# EAGLE design 607_motor (EAGLE 9.6.2)
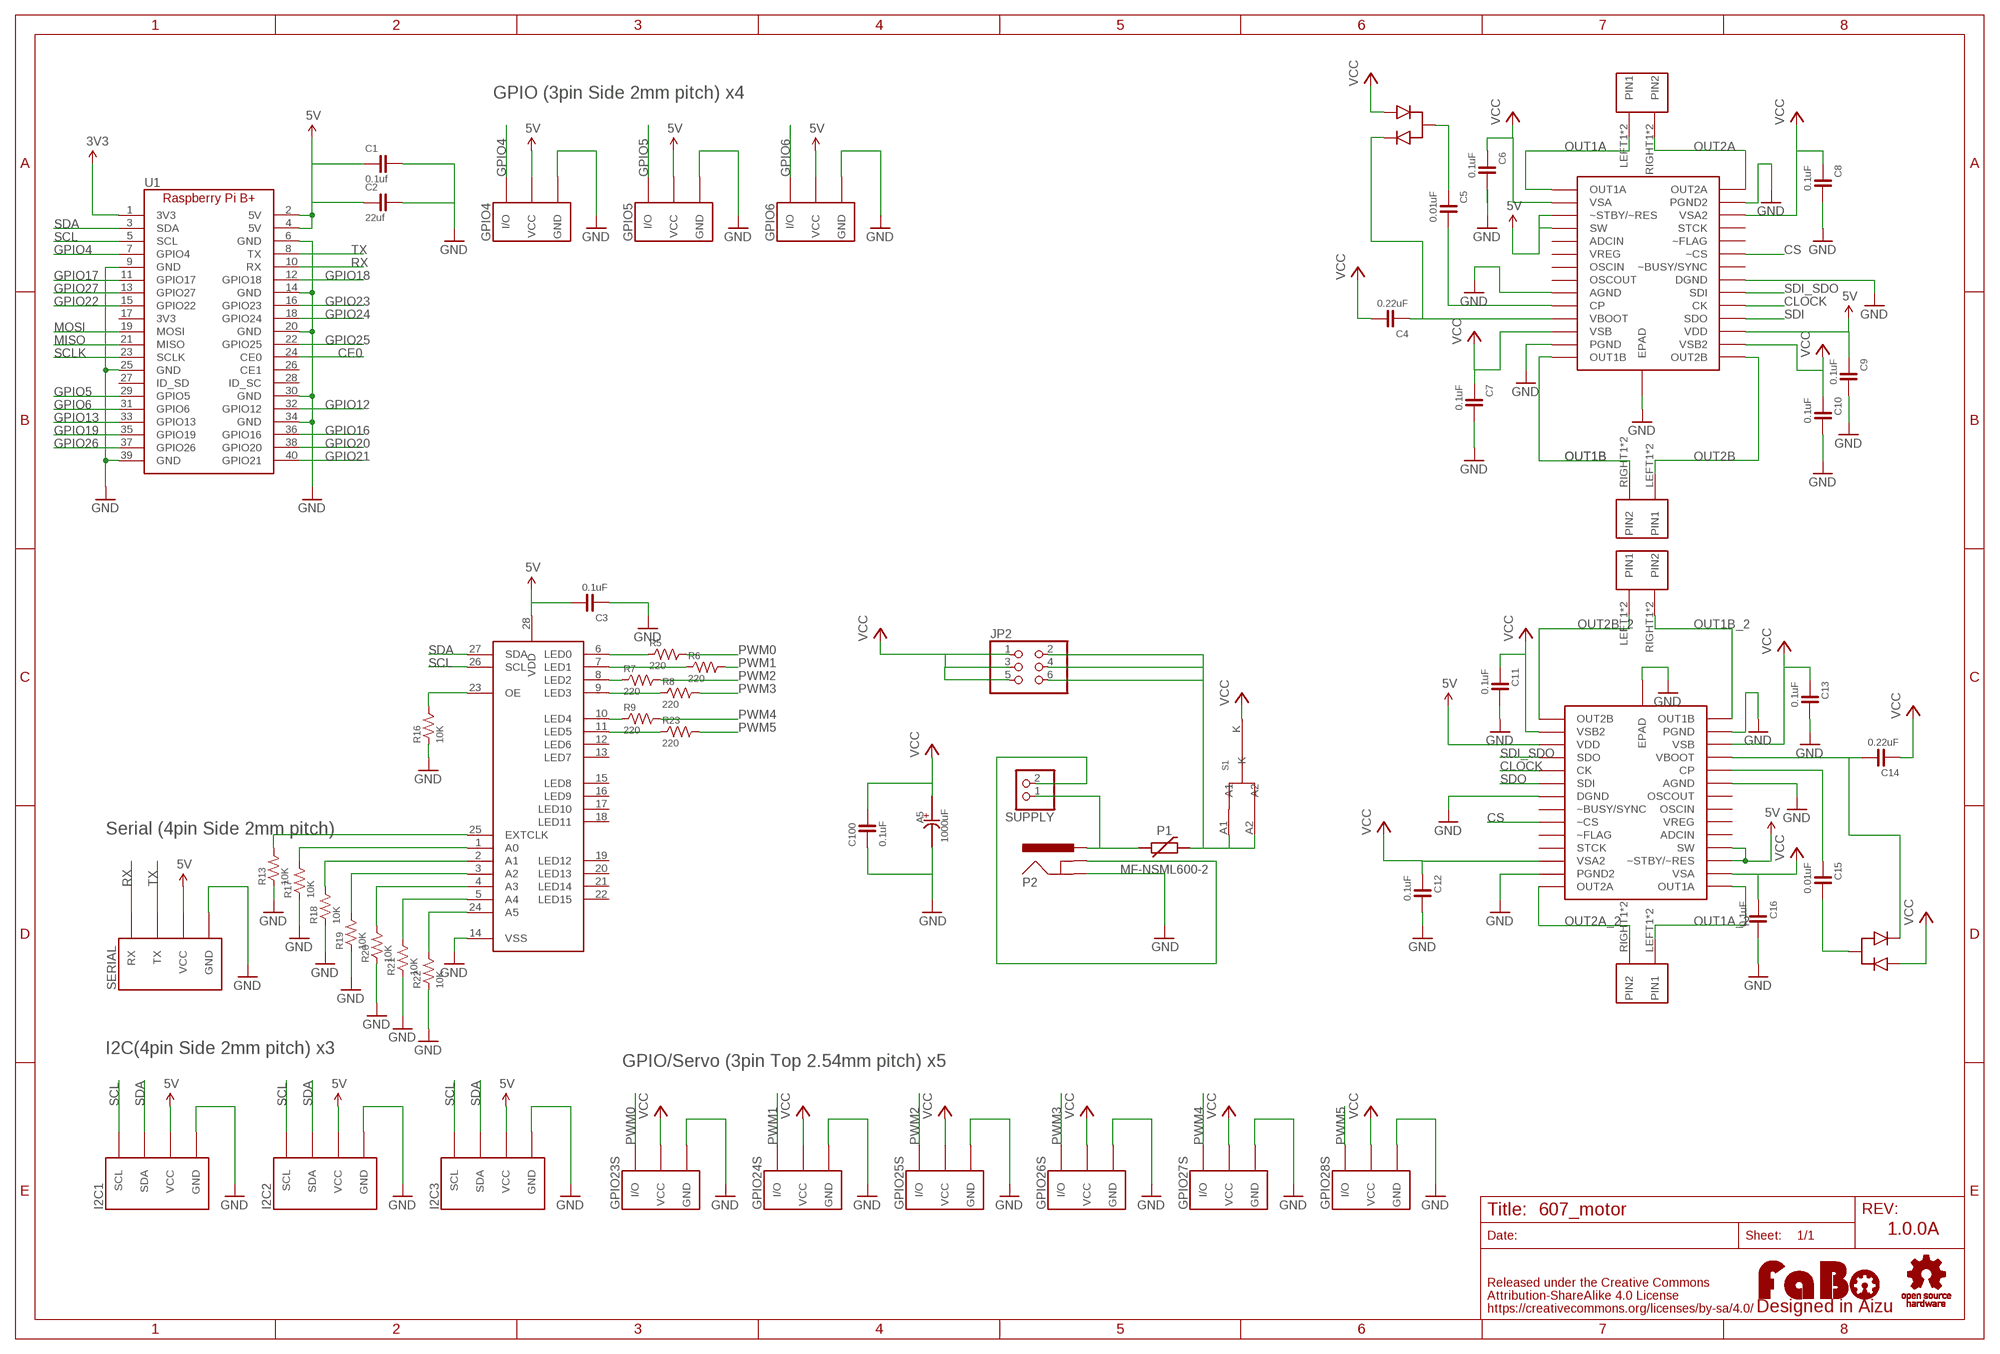
[diagram p0: schematic, sheet 1]

## Parts
A5  1000uF  CAPACITOR-ALUMIN_D12_5  [D12.5]
C1  0.1uf  CAPACITOR-0603  [0603]
C2  22uf  CAPACITOR-0603  [0603]
C3  0.1uF  CAPACITOR-0603  [0603]
C4  0.22uF  CAPACITOR-0603  [0603]
C5  0.01uF  CAPACITOR-0603  [0603]
C6  0.1uF  CAPACITOR-0603  [0603]
C7  0.1uF  CAPACITOR-0603  [0603]
C8  0.1uF  CAPACITOR-0603  [0603]
C9  0.1uF  CAPACITOR-0603  [0603]
C10  0.1uF  CAPACITOR-0603  [0603]
C11  0.1uF  CAPACITOR-0603  [0603]
C12  0.1uF  CAPACITOR-0603  [0603]
C13  0.1uF  CAPACITOR-0603  [0603]
C14  0.22uF  CAPACITOR-0603  [0603]
C15  0.01uF  CAPACITOR-0603  [0603]
C16  0.1uF  CAPACITOR-0603  [0603]
C100  0.1uF  CAPACITOR-0603  [0603]
GPIO4  FABO_BRICK_3PIN-S03B-PASK-2  [FABO_BRICK_3PIN_S03B-PASK-2]
GPIO5  FABO_BRICK_3PIN-S03B-PASK-2  [FABO_BRICK_3PIN_S03B-PASK-2]
GPIO6  FABO_BRICK_3PIN-S03B-PASK-2  [FABO_BRICK_3PIN_S03B-PASK-2]
GPIO23S  FABO_BRICK_3PIN-HEADER  [FABO_BRICK_3PIN_HEADER]
GPIO24S  FABO_BRICK_3PIN-HEADER  [FABO_BRICK_3PIN_HEADER]
GPIO25S  FABO_BRICK_3PIN-HEADER  [FABO_BRICK_3PIN_HEADER]
GPIO26S  FABO_BRICK_3PIN-HEADER  [FABO_BRICK_3PIN_HEADER]
GPIO27S  FABO_BRICK_3PIN-HEADER  [FABO_BRICK_3PIN_HEADER]
GPIO28S  FABO_BRICK_3PIN-HEADER  [FABO_BRICK_3PIN_HEADER]
I2C1  FABO_BRICK_I2C-S04B-PASK-2  [FABO_BRICK_I2C_S04B-PASK-2]
I2C2  FABO_BRICK_I2C-S04B-PASK-2  [FABO_BRICK_I2C_S04B-PASK-2]
I2C3  FABO_BRICK_I2C-S04B-PASK-2  [FABO_BRICK_I2C_S04B-PASK-2]
JP2  PINHD-2X3  [2X03]
LOGO1  LOGO_FABO-M  [LOGO_FABO_M]
P1  MF-NSML600-2  POLYSWITCH1206  [1206]
P2  DC-JACKM04339A0  [M04339A0]
R5  220  RESISTOR-0603  [0603]
R6  220  RESISTOR-0603  [0603]
R7  220  RESISTOR-0603  [0603]
R8  220  RESISTOR-0603  [0603]
R9  220  RESISTOR-0603  [0603]
R13  10K  RESISTOR-0402  [0402]
R16  10K  RESISTOR-0603  [0603]
R17  10K  RESISTOR-0603  [0603]
R18  10K  RESISTOR-0603  [0603]
R19  10K  RESISTOR-0603  [0603]
R20  10K  RESISTOR-0603  [0603]
R21  10K  RESISTOR-0603  [0603]
R22  10K  RESISTOR-0402  [0402]
R23  220  RESISTOR-0603  [0603]
S1  STPS15L30C  [STPS15L30C]
SERIAL  FABO_BRICK_SERIAL-S04B-PASK-2  [FABO_BRICK_SERIAL_S04B-PASK-2]
SUPPLY  PINHD-1X2  [1X02]
U1  RASPBERRY_PI_B+  [RASPBERRY_PI_B+]
U$4  LOGO_OSHW-M_BOTTOM  [LOGO_OSHW_M_BOTTOM]
U$8  L6470L6470  [L6470]
U$9  PCA9685  [PCA9685]
U$10  BAV99  [BAV99]
U$11  L6470L6470  [L6470]
U$12  BAV99  [BAV99]
U$13  ML-1400-S1  [ML-1400-S1]
U$15  ML-1400-S1  [ML-1400-S1]
U$16  ML-1400-S1  [ML-1400-S1]
U$17  ML-1400-S1  [ML-1400-S1]

## Nets
3V3: U1.1(3V3)
5V: C1.1 C2.1 C3.2 C9.1 GPIO4.VCC GPIO5.VCC GPIO6.VCC I2C1.VCC I2C2.VCC I2C3.VCC SERIAL.VCC U1.2(5V) U1.4(5V) U$8.VDD U$8.~STBY/~RES U$9.28(VDD) U$11.SW U$11.VDD U$11.~STBY/~RES
CE0: U1.24(CE0)
CLOCK: U$8.CK U$11.CK
CS: U$8.~CS U$11.~CS
GND: A5.- C1.2 C2.2 C3.1 C6.2 C7.2 C8.2 C9.2 C10.2 C11.2 C12.2 C13.2 C16.2 C100.1 GPIO4.GND GPIO5.GND GPIO6.GND GPIO23S.GND GPIO24S.GND GPIO25S.GND GPIO26S.GND GPIO27S.GND GPIO28S.GND I2C1.GND I2C2.GND I2C3.GND P2.GND R13.P$1 R16.1 R17.1 R18.1 R19.1 R20.1 R21.1 R22.P$1 SERIAL.GND U1.6(GND) U1.9(GND) U1.14(GND) U1.20(GND) U1.25(GND) U1.30(GND) U1.34(GND) U1.39(GND) U$8.AGND U$8.DGND U$8.EPAD U$8.PGND U$8.PGND2 U$9.14(VSS) U$11.AGND U$11.DGND U$11.EPAD U$11.PGND U$11.PGND2
GPIO4: GPIO4.I/O U1.7(GPIO4)
GPIO5: GPIO5.I/O U1.29(GPIO5)
GPIO6: GPIO6.I/O U1.31(GPIO6)
GPIO12: U1.32(GPIO12)
GPIO13: U1.33(GPIO13)
GPIO16: U1.36(GPIO16)
GPIO17: U1.11(GPIO17)
GPIO18: U1.12(GPIO18)
GPIO19: U1.35(GPIO19)
GPIO20: U1.38(GPIO20)
GPIO21: U1.40(GPIO21)
GPIO22: U1.15(GPIO22)
GPIO23: U1.16(GPIO23)
GPIO24: U1.18(GPIO24)
GPIO25: U1.22(GPIO25)
GPIO26: U1.37(GPIO26)
GPIO27: U1.13(GPIO27)
LED0: R5.1 U$9.6(LED0)
LED1: R6.1 U$9.7(LED1)
LED2: R7.1 U$9.8(LED2)
LED3: R8.1 U$9.9(LED3)
LED4: R9.1 U$9.10(LED4)
LED5: R23.1 U$9.11(LED5)
MISO: U1.21(MISO)
MOSI: U1.19(MOSI)
N$3: C14.2 U$11.VBOOT U$12.CASORD
N$5: P1.P$1 P2.VCC(PWR) SUPPLY.1
N$7: R16.2 U$9.23(OE)
N$8: R13.P$2 U$9.25(EXTCLK)
N$9: R17.2 U$9.1(A0)
N$10: R18.2 U$9.2(A1)
N$11: R19.2 U$9.3(A2)
N$12: R20.2 U$9.4(A3)
N$13: R21.2 U$9.5(A4)
N$14: R22.P$2 U$9.24(A5)
N$15: JP2.2 JP2.4 JP2.6 P1.P$2 S1.A1 S1.A2
N$16: C4.1 U$8.VBOOT U$10.CASORD
N$17: P2.GNDBREAK SUPPLY.2
N$18: C5.1 U$10.A/C
N$25: C15.2 U$12.A/C
N$26: C15.1 U$11.CP
N$27: C5.2 U$8.CP
N$28: U$8.SW
OUT1A: U$8.OUT1A U$15.LEFT1(PIN1) U$15.LEFT2(PIN1)
OUT1A_2: U$11.OUT1A U$17.LEFT1(PIN1) U$17.LEFT2(PIN1)
OUT1B: U$8.OUT1B U$13.RIGHT1(PIN2) U$13.RIGHT2(PIN2)
OUT1B_2: U$11.OUT1B U$16.RIGHT1(PIN2) U$16.RIGHT2(PIN2)
OUT2A: U$8.OUT2A U$15.RIGHT1(PIN2) U$15.RIGHT2(PIN2)
OUT2A_2: U$11.OUT2A U$17.RIGHT1(PIN2) U$17.RIGHT2(PIN2)
OUT2B: U$8.OUT2B U$13.LEFT1(PIN1) U$13.LEFT2(PIN1)
OUT2B_2: U$11.OUT2B U$16.LEFT1(PIN1) U$16.LEFT2(PIN1)
PWM0: GPIO23S.I/O R5.2
PWM1: GPIO24S.I/O R6.2
PWM2: GPIO25S.I/O R7.2
PWM3: GPIO26S.I/O R8.2
PWM4: GPIO27S.I/O R9.2
PWM5: GPIO28S.I/O R23.2
RX: SERIAL.RX U1.10(RX)
SCL: I2C1.SCL I2C2.SCL I2C3.SCL U1.5(SCL) U$9.26(SCL)
SCLK: U1.23(SCLK)
SDA: I2C1.SDA I2C2.SDA I2C3.SDA U1.3(SDA) U$9.27(SDA)
SDI: U$8.SDO
SDI_SDO: U$8.SDI U$11.SDO
SDO: U$11.SDI
TX: SERIAL.TX U1.8(TX)
VCC: A5.+ C4.2 C6.1 C7.1 C8.1 C10.1 C11.1 C12.1 C13.1 C14.1 C16.1 C100.2 GPIO23S.VCC GPIO24S.VCC GPIO25S.VCC GPIO26S.VCC GPIO27S.VCC GPIO28S.VCC JP2.1 JP2.3 JP2.5 S1.K U$8.VSA U$8.VSA2 U$8.VSB U$8.VSB2 U$10.ANORD U$11.VSA U$11.VSA2 U$11.VSB U$11.VSB2 U$12.ANORD
Unconnected: U1.17(3V3) U1.26(CE1) U1.27(ID_SD) U1.28(ID_SC) U$8.ADCIN U$8.OSCIN U$8.OSCOUT U$8.STCK U$8.VREG U$8.~BUSY/RST(~BUSY/SYNC) U$8.~FLAG U$9.12(LED6) U$9.13(LED7) U$9.15(LED8) U$9.16(LED9) U$9.17(LED10) U$9.18(LED11) U$9.19(LED12) U$9.20(LED13) U$9.21(LED14) U$9.22(LED15) U$11.ADCIN U$11.OSCIN U$11.OSCOUT U$11.STCK U$11.VREG U$11.~BUSY/RST(~BUSY/SYNC) U$11.~FLAG

## Notes on the sheet
- GPIO (3pin Side 2mm pitch) x4
- Serial (4pin Side 2mm pitch)
- I2C(4pin Side 2mm pitch) x3
- GPIO/Servo (3pin Top 2.54mm pitch) x5
- 1.0.0A

## Library data of the parts
A5 = FaBo-Capacitor:CAPACITOR-ALUMIN
C1-C16 C100 = FaBo-Capacitor:CAPACITOR: CAPACITOR
GPIO4-GPIO6 GPIO23S GPIO24S GPIO25S GPIO26S GPIO27S GPIO28S = FaBo-Template:FABO_BRICK_3PIN: FaBo Brick 3pin
I2C1-I2C3 = FaBo-Template:FABO_BRICK_I2C: FaBo Brick I2C
JP2 = pinhead:PINHD-2X3: PIN HEADER
LOGO1 = component:LOGO_FABO
P1 = FaBo-Supply:POLYSWITCH
P2 = FaBo-Supply:DC-JACK
R5-R9 R13 R16-R23 = FaBo-Resistors:RESISTOR: RESISTOR
S1 = FaBo-Supply:STPS15L30C
SERIAL = FaBo-Template:FABO_BRICK_SERIAL: FaBo Brick Serial
SUPPLY = pinhead:PINHD-1X2: PIN HEADER
U1 = FaBo-Boards:RASPBERRY_PI_B+
U$4 = component:LOGO_OSHW
U$8 U$11 = Myparts:L6470
U$9 = FaBo-Motor:PCA9685
U$10 U$12 = Myparts:BAV99
U$13 U$15-U$17 = FaBo-Terminal:ML-1400-S1

## Board
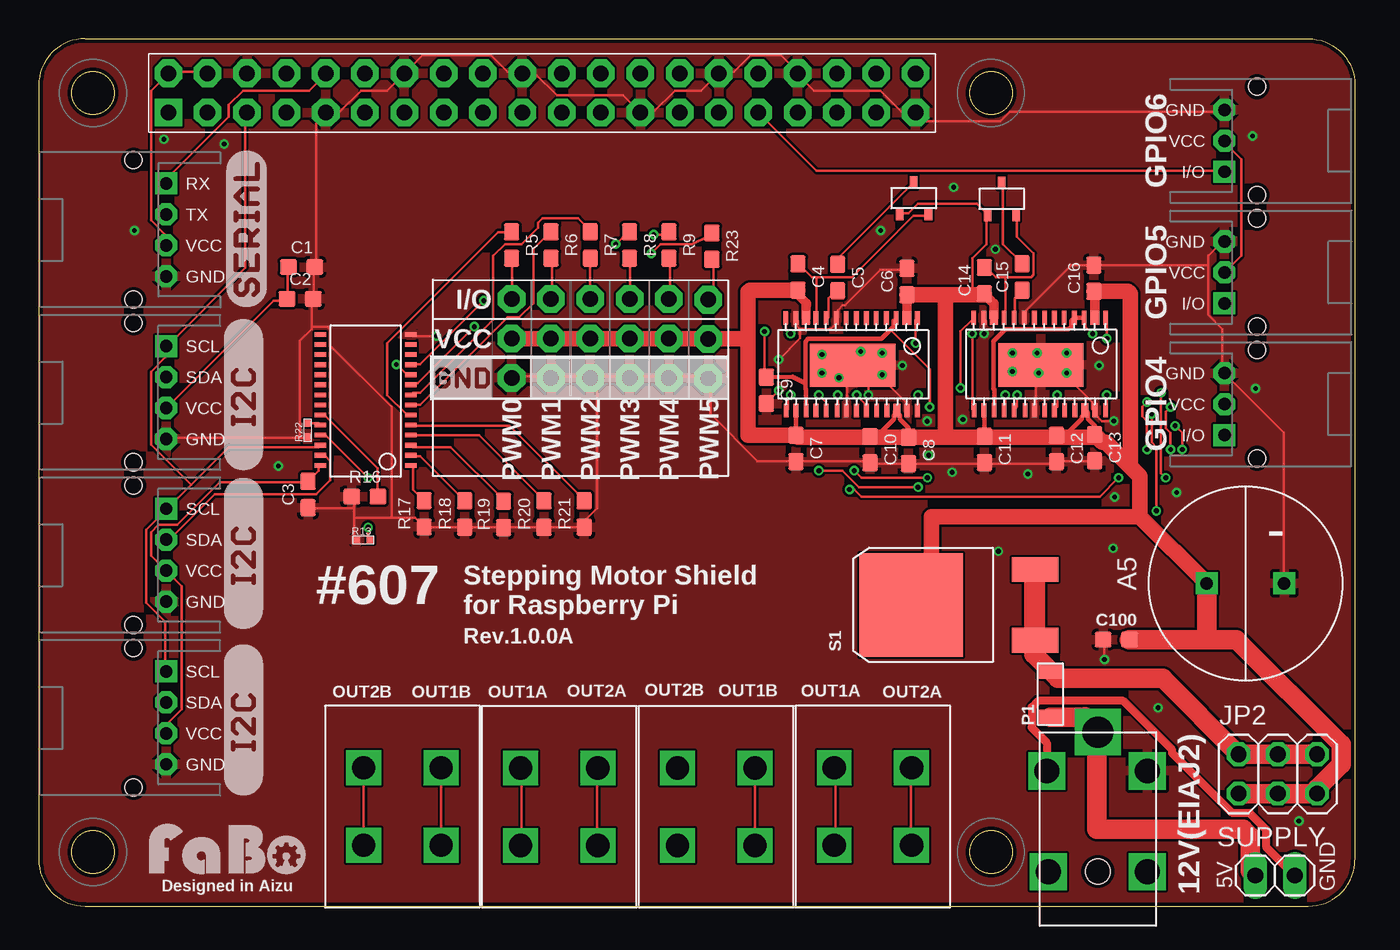
[diagram p1: board, top side]
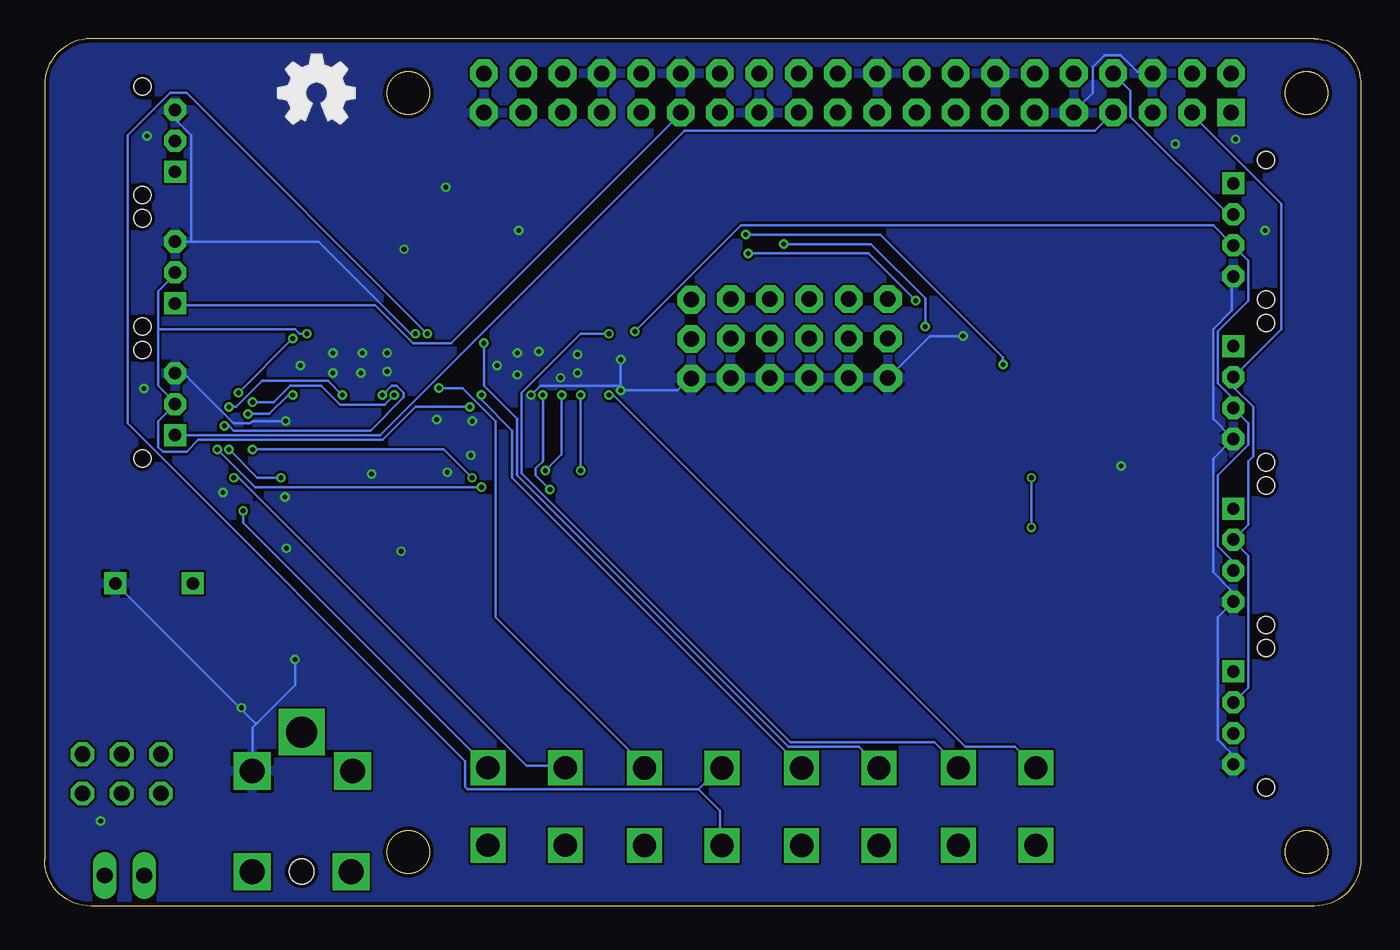
[diagram p2: board, bottom side, seen from below]

Size 85 x 56 mm. Coordinates in mm from the lower left corner, seen from the top.
Copper layers (1*16): Top 0.035mm / dielectric 1.6mm / Bottom 0.035mm
Design rules "PCBway": minimum track width 6mil, minimum drill 12mil, track to track 6mil, track to pad 6mil, pad to pad 6mil, via to via 6mil, smd to smd 6mil, copper to edge 10mil, drill to drill 10mil, minimum pad ring 10mil, minimum via ring 6mil, stop-mask expansion 2mil, vias tented up to drill 100mil, thermal gap 8mil

### Footprints (pad centres in the part's own frame; a part is rotated, then mirrored left to right if it is on the bottom)
D12.5 = drill 0.8 pad 1.422 square: + -2.472,0.254; - 2.528,0.254
0603 = smd 1.1 x 1: 1 -0.85,0; 2 0.85,0
FABO_BRICK_3PIN_S03B-PASK-2 = drill 0.8 pad 1.422 octagon: GND -2,0; VCC 0,0 | drill 0.8 pad 1.422 square: I/O 2,0 | hole 1.1: 3.5,2.1; -3.5,2.1
FABO_BRICK_3PIN_HEADER = drill 1 pad 1.778 octagon: GND -2.54,0; I/O 2.54,0; VCC 0,0
FABO_BRICK_I2C_S04B-PASK-2 = drill 0.8 pad 1.422 octagon: GND -3,0; SDA 1,0; VCC -1,0 | drill 0.8 pad 1.422 square: SCL 3,0 | hole 1.1: 4.5,2.1; -4.5,2.1
2X03 = drill 1.016 octagon: 1 -2.54,-1.27; 2 -2.54,1.27; 3 0,-1.27; 4 0,1.27; 5 2.54,-1.27; 6 2.54,1.27
1206 = smd 1 x 1.6: P$1 -1.5,0; P$2 1.5,0
M04339A0 = drill 1.6 square: GND -3.2,-6.5; GNDBREAK 3.3,-6.5; ND1 -3.2,0; ND2 3.2,0 | drill 2 square: VCC 0,-9 | hole 1.6: 0,0
0402 = smd 0.5 x 0.5: P$1 -0.46,0; P$2 0.46,0
STPS15L30C = smd 1.6 x 3: A1 -2.286,-6.13; A2 2.286,-6.13 | smd 6.7 x 6.7: K 0,1.87
FABO_BRICK_SERIAL_S04B-PASK-2 = drill 0.8 pad 1.422 octagon: GND -3,0; TX 1,0; VCC -1,0 | drill 0.8 pad 1.422 square: RX 3,0 | hole 1.1: 4.5,2.1; -4.5,2.1
1X02 = drill 1.016 long: 1 -1.27,0; 2 1.27,0
RASPBERRY_PI_B+ = drill 1 pad 1.778 square: 1 0,-2.54 | drill 1 pad 1.778 octagon: 2 0,0; 3 2.54,-2.54; 4 2.54,0; 5 5.08,-2.54; 6 5.08,0; 7 7.62,-2.54; 8 7.62,0; 9 10.16,-2.54; 10 10.16,0; 11 12.7,-2.54; 12 12.7,0; 13 15.24,-2.54; 14 15.24,0; 15 17.78,-2.54; 16 17.78,0; 17 20.32,-2.54; 18 20.32,0; 19 22.86,-2.54; 20 22.86,0; 21 25.4,-2.54; 22 25.4,0; 23 27.94,-2.54; 24 27.94,0; 25 30.48,-2.54; 26 30.48,0; 27 33.02,-2.54; 28 33.02,0; 29 35.56,-2.54; 30 35.56,0; 31 38.1,-2.54; 32 38.1,0; 33 40.64,-2.54; 34 40.64,0; 35 43.18,-2.54; 36 43.18,0; 37 45.72,-2.54; 38 45.72,0; 39 48.26,-2.54; 40 48.26,0
L6470 = smd 0.889 x 0.305: ADCIN -0.802,-3.335; AGND -0.802,-5.926; CK 5.167,-6.561; CP -0.802,-6.561; DGND 5.167,-5.265; OSCIN -0.802,-4.605; OSCOUT -0.802,-5.265; OUT1A -0.802,-0.668; OUT1B -0.802,-9.177; OUT2A 5.167,-0.668; OUT2B 5.167,-9.152; PGND -0.802,-8.517; PGND2 5.167,-1.354; SDI 5.167,-5.85; SDO 5.167,-7.221; STCK 5.167,-2.649; SW -0.802,-2.675; VBOOT -0.802,-7.221; VDD 5.167,-7.856; VREG -0.802,-3.97; VSB2 5.167,-8.517; ~BUSY/RST 5.167,-4.605; ~CS 5.167,-3.97; ~FLAG 5.167,-3.31; ~STBY/~RES -0.802,-2.04 | smd 2.8 x 5.5: EPAD 2.25,-4.85 | smd 0.889 x 0.559: VSA -0.802,-1.354 | smd 0.889 x 0.457: VSA2 5.167,-1.989 | smd 0.889 x 0.508: VSB -0.802,-7.882
PCA9685 = smd 0.3 x 0.75: 1 -4.15,-2.93; 2 -3.5,-2.93; 3 -2.85,-2.93; 4 -2.2,-2.93; 5 -1.55,-2.93; 6 -0.9,-2.93; 7 -0.25,-2.93; 8 0.4,-2.93; 9 1.05,-2.93; 10 1.7,-2.93; 11 2.35,-2.93; 12 3,-2.93; 13 3.65,-2.93; 14 4.3,-2.93; 15 4.3,2.92; 16 3.65,2.92; 17 3,2.92; 18 2.35,2.92; 19 1.7,2.92; 20 1.05,2.92; 21 0.4,2.92; 22 -0.25,2.92; 23 -0.9,2.92; 24 -1.55,2.92; 25 -2.2,2.92; 26 -2.85,2.92; 27 -3.5,2.92; 28 -4.15,2.92
BAV99 = smd 0.5 x 0.8: A/C 0,1.68; ANORD -0.91,-0.37; CASORD 0.94,-0.37
ML-1400-S1 = drill 1.5 square: LEFT1 -2.5,2.5; LEFT2 -2.5,-2.5; RIGHT1 2.5,2.5; RIGHT2 2.5,-2.5

### Placement (x,y rotation side)
A5  77.9,20.58 0 top
C1  16.98,41.26 0 top
C2  16.88,39.21 0 top
C3  17.39,26.57 90 top
C4  49.03,40.62 270 top
C5  51.6,40.58 270 top
C6  56.07,40.32 90 top
C7  48.9,29.55 270 top
C8  56.17,29.42 270 top
C9  46.99,33.3 270 top
C10  53.69,29.47 270 top
C11  61.08,29.48 270 top
C12  65.73,29.54 270 top
C13  68.19,29.6 270 top
C14  61.07,40.38 90 top
C15  63.51,40.62 90 top
C16  68.14,40.54 90 top
C100  69.59,17.21 0 top
GPIO4  76.58,32.41 270 top
GPIO5  76.58,40.91 270 top
GPIO6  76.58,49.41 270 top
GPIO23S  30.54,36.65 90 top
GPIO24S  33.08,36.65 90 top
GPIO25S  35.62,36.65 90 top
GPIO26S  38.16,36.65 90 top
GPIO27S  40.7,36.65 90 top
GPIO28S  43.25,36.61 90 top
I2C1  8.23,33.16 90 top
I2C2  8.23,22.66 90 top
I2C3  8.23,12.16 90 top
JP2  80.02,8.54 0 top
LOGO1  12.18,1.7 0 top
P1  65.33,13.69 90 top
P2  68.4,2.23 180 top
R5  30.54,42.68 270 top
R6  33.08,42.68 270 top
R7  35.62,42.68 270 top
R8  38.16,42.68 270 top
R9  40.7,42.68 270 top
R13  20.96,23.64 0 top
R16  21.06,26.44 0 top
R17  24.89,25.33 90 top
R18  27.51,25.32 90 top
R19  30.02,25.29 90 top
R20  32.63,25.31 90 top
R21  35.23,25.32 90 top
R22  17.36,30.73 90 top
R23  43.47,42.61 270 top
S1  58.22,19.45 90 top
SERIAL  8.23,43.66 90 top
SUPPLY  79.84,1.98 0 top
U1  8.37,53.77 0 top
U$2  [LOGO_SILK_I2C]  14.48,17.91 90 top
U$3  [LOGO_SILK_SERIAL2]  14.73,38.66 90 top
U$4  67.42,52.5 0 top
U$5  [LOGO_SILK_I2C]  14.48,7.16 90 top
U$6  [LOGO_SILK_I2C]  14.48,28.16 90 top
U$7  [LOGO_SILK_GND]  25.46,32.84 0 top
U$8  57.42,37.17 270 top
U$9  21.11,32.61 90 top
U$10  56.51,45.05 0 top
U$11  69.56,37.19 270 top
U$12  62.19,45 0 top
U$13  23.49,6.43 0 top
U$15  33.61,6.42 0 top
U$16  43.75,6.42 0 top
U$17  53.87,6.43 0 top

### Tracks (layer width: path | path; a pad name or v marks a point on that pad's centre or on a via)
5V  (via drill 0.3)
  Top 0.152: U$8.~STBY/~RES 55.26,37.87 55.2,37.79 | 55.01,37.21 57.54,34.67 v57.54,32.23 | GPIO6.VCC 76.59,49.3 77.66,48.23 77.66,41.98 76.59,40.92 GPIO5.VCC | v68.06,36.96 67.6,37.41 67.6,37.87 U$11.~STBY/~RES | U$9.28 18.07,28.42 18.07,28.12 17.46,27.51 C3.2 17.31,27.35 11.67,27.35 8.93,24.61 7.71,24.61 7.25,24.15 7.25,22.63 8.17,21.72 I2C2.VCC 8.32,21.56 9.23,20.65 9.23,12.72 8.32,11.81 8.32,11.2 I2C3.VCC | C1.1 16.09,41.22 16.09,39.24 C2.1 15.94,39.09 15.18,39.09 8.32,32.23 I2C1.VCC | SERIAL.VCC 8.17,42.75 8.17,43.36 7.25,44.27 7.25,52.65 U1.2 8.47,53.87 10.91,53.87 U1.4 | v46.88,37.11 46.88,34.21 C9.1
  Top 0.305: 55.2,37.79 55.2,37.4 55.01,37.21 54.43,36.63 49.69,36.63 49.51,36.45 49.51,33.77 | 49.51,33.77 49.51,33.39 49.56,33.35 U$8.VDD | U$11.~STBY/~RES U$11.SW 66.68,37.79 66.68,37.42 66.5,37.24 62.43,37.24 61.65,36.47 61.65,34.1 61.65,33.41 61.7,33.37 U$11.VDD | 49.51,33.77 48.67,34.18 C9.1
  Bottom 0.152: v57.54,32.23 61.05,32.23 63.18,30.1 75.07,30.1 75.83,29.34 77.36,29.34 77.66,29.64 77.66,31.32 76.59,32.38 GPIO4.VCC 76.59,32.54 77.66,33.6 77.66,37.26 | 77.66,37.26 77.66,39.7 76.59,40.77 GPIO5.VCC | v68.06,36.96 68.52,36.96 68.82,37.26 77.66,37.26 | I2C2.VCC 8.32,21.72 8.32,22.33 9.23,23.24 9.23,27.81 7.25,29.79 7.25,31.16 8.17,32.08 I2C1.VCC 8.32,32.23 8.32,32.84 9.23,33.76 9.23,37.11 7.25,39.09 7.25,41.68 8.17,42.59 SERIAL.VCC 8.32,42.75 9.54,43.97 40.02,43.97 v46.88,37.11
CLOCK  (via drill 0.3)
  Top 0.152: v50.38,32.99 50.84,32.54 50.84,32.08 U$8.CK | v50.38,28.12 51.91,28.12 52.97,27.05 v56.78,27.05 | v73.85,29.49 73.85,30.55 v73.39,31.01 | v63.18,32.99 63.18,32.23 63.03,32.08 U$11.CK
  Bottom 0.152: v50.38,28.12 v50.38,32.99 | v56.78,27.05 71.41,27.05 v73.85,29.49 | v73.39,31.01 73.09,31.01 72.78,30.71 63.95,30.71 61.81,32.84 61.81,33.15 62.27,33.6 62.57,33.6 v63.18,32.99
CS  (via drill 0.3)
  Top 0.152: v52.82,32.99 53.43,32.38 53.43,32.08 U$8.~CS | v52.36,26.9 52.67,26.9 53.12,26.44 68.52,26.44 v69.74,27.66 | v73.09,29.49 73.09,30.55 72.78,30.86 72.78,31.93 v73.09,32.23 | v65.77,32.99 65.77,32.23 65.62,32.08 U$11.~CS
  Bottom 0.152: v52.82,32.99 52.82,28.73 53.28,28.27 53.28,27.81 v52.36,26.9 | v69.74,27.66 71.26,27.66 v73.09,29.49 | v73.09,32.23 72.63,32.23 70.96,33.91 66.69,33.91 v65.77,32.99
GND  (via drill 0.3)
  Top 0.152: 20.36,25.68 20.36,26.44 R16.1 | 20.36,25.68 20.36,25.07 | 20.36,25.07 20.36,23.7 R13.P$1 | 20.36,25.68 17.46,25.68 C3.1 | 22.8,25.07 24.32,25.07 24.78,24.61 R17.1 24.93,24.46 27.37,24.46 R18.1 27.52,24.46 29.96,24.46 R19.1 30.11,24.46 32.55,24.46 R20.1 32.7,24.46 35.14,24.46 R21.1 35.29,24.61 35.29,24.92 36.06,25.68 36.06,34.21 | 22.8,25.07 20.36,25.07 | C13.2 68.06,28.73 65.77,28.73 C12.2 65.62,28.57 61.2,28.57 C11.2 61.05,28.57 C8.2 56.02,28.57 53.73,28.57 C10.2 53.58,28.73 49.01,28.73 C7.2 48.86,28.73 46.42,28.73 43.37,31.77 43.37,34.06 GPIO28S.GND 43.22,34.21 40.78,34.21 GPIO27S.GND 40.63,34.21 38.19,34.21 GPIO26S.GND 38.04,34.21 36.06,34.21 | 52.21,33.6 52.21,34.52 52.51,34.82 U$8.EPAD | 52.21,33.6 52.21,32.08 U$8.DGND | 52.21,33.6 53.58,33.6 | 53.58,33.6 54.95,33.6 56.02,32.54 56.02,32.08 U$8.PGND2 | 52.21,33.6 U$8.EPAD | v25.69,36.8 24.17,36.8 U$9.14 | GPIO25S.GND 35.6,34.21 33.16,34.21 GPIO24S.GND 33.01,34.21 30.57,34.21 GPIO23S.GND | 36.06,34.21 35.75,34.21 GPIO25S.GND | 49.16,37.26 48.86,37.57 48.86,37.87 U$8.PGND | 49.16,37.26 51.14,37.26 51.45,37.57 51.45,37.87 U$8.AGND 51.6,38.02 51.6,38.48 51.91,38.78 52.06,38.78 54.34,41.07 56.02,41.07 C6.2 | v47.79,33.3 47.03,32.54 C9.2 | 49.16,37.26 49.16,36.65 v47.79,35.28 | v53.58,32.99 53.58,33.6 | 53.58,33.6 U$8.EPAD | 36.06,34.21 GPIO25S.GND | v68.82,15.92 68.82,17.14 C100.1 | 64.4,33.6 64.4,34.52 64.71,34.82 U$11.EPAD 64.4,33.6 | 64.4,33.6 64.4,32.08 U$11.DGND | 64.4,33.6 66.99,33.6 68.06,32.54 68.06,32.08 U$11.PGND2 68.21,31.93 68.21,31.77 68.67,31.32 v69.43,31.32 | U$11.AGND 63.64,38.02 63.64,38.33 66.69,41.38 68.06,41.38 C16.2 68.21,41.38 75.53,41.38
  Top 0.152: v61.05,36.96 61.05,37.87 U$11.PGND | 75.53,41.38 75.53,41.98 76.44,42.9 GPIO5.GND | 75.53,41.38 75.53,38.17 76.44,37.26 76.44,34.52 GPIO4.GND 76.59,34.36 80.4,30.55 80.4,20.95 A5.- | 16.85,30.25 8.32,30.25 I2C1.GND | 16.85,30.25 17.31,30.25 R22.P$1 | 17.62,37.41 17.62,37.26 16.85,36.5 16.85,30.25 | 17.62,37.41 17.62,39.09 C2.2 17.77,39.24 17.77,41.22 C1.2 17.92,41.38 17.92,50.52 18.53,51.13 U1.9 18.53,51.28 19.44,51.28 20.82,52.65 22.49,52.65 U1.14 24.78,54.94 29.2,54.94 30.27,53.87 31.18,53.87 U1.20 31.33,53.72 32.09,53.72 33.46,52.35 37.73,52.35 U1.25 38.95,51.28 39.71,51.28 41.08,52.65 42.76,52.65 43.83,53.72 U1.30 43.98,53.87 44.89,53.87 45.96,54.94 47.94,54.94 49.01,53.87 U1.34 49.01,53.72 50.08,52.65 54.34,52.65 55.72,51.28 56.63,51.28 U1.39 56.63,51.13 57.09,50.67 62.12,50.67 62.73,51.28 76.44,51.28 GPIO6.GND | 22.8,25.07 22.8,32.23 18.84,36.19 18.84,37.26 18.68,37.41 17.62,37.41
  Bottom 0.152: v25.69,36.8 27.83,36.8 30.42,34.21 GPIO23S.GND | GPIO28S.GND 43.37,34.06 44.13,33.3 v47.79,33.3 47.79,33.6 | 47.79,33.6 v47.79,35.28 | v53.58,32.99 52.97,33.6 47.79,33.6 | v68.82,15.92 68.82,14.25 71.26,11.81 | 71.26,11.81 71.56,11.5 71.56,8.76 P2.GND | 71.26,11.81 71.41,11.81 80.4,20.8 A5.- | v61.05,36.96 61.35,36.96 67.3,42.9 75.53,42.9 | 75.53,42.9 76.44,42.9 GPIO5.GND | 75.53,42.9 75.53,49.76 76.44,50.67 76.44,51.28 GPIO6.GND | v69.43,31.32 71.56,31.32 71.72,31.16 72.78,31.16 75.98,34.36 76.44,34.36 GPIO4.GND | I2C3.GND 8.32,9.22 8.32,9.83 9.23,10.74 9.23,18.67 8.32,19.58 I2C2.GND 8.32,19.73 8.32,20.34 9.54,21.56 9.54,28.88 8.32,30.1 I2C1.GND 8.32,30.25 9.54,31.47 9.54,37.26 8.32,38.48 8.32,40.61 SERIAL.GND | U1.6 13.5,53.87 14.41,53.87 15.48,54.94 16.55,54.94 17.31,54.18 17.31,52.5 18.53,51.28 U1.9
  other vias: 61.98,22.91 72.28,12.81 81.38,5.51 15.48,28.41 62.88,35.71 64.48,35.71 66.38,35.71 66.38,34.41 64.58,34.41 62.88,34.51 54.48,35.71 54.48,34.31 50.58,34.41 50.58,35.61 53.08,35.81 51.68,34.11 68.48,34.91 55.78,34.91 58.98,28.01 63.88,27.91 73.48,26.71 69.38,23.11 69.48,26.41 78.58,33.41 54.38,43.61 59.08,46.41 61.78,42.41 57.48,29.11 59.68,31.41 57.38,31.31 6.18,43.61 11.98,49.21 8.08,49.51 78.38,49.71
  pour Bottom: -0.52,-0.84 -0.52,56.66 85.73,56.66 85.73,-0.84
  pour Top: -0.52,-0.84 -0.52,56.66 85.73,56.66 85.73,-0.84
GPIO4
  Bottom 0.152: U1.7 17.16,50.06 43.68,50.06 63.34,30.4 76.44,30.4 GPIO4.I/O
GPIO5
  Bottom 0.152: GPIO5.I/O 76.44,38.78 63.64,38.78 61.2,36.35 58.76,36.35 43.98,51.13 U1.29
GPIO6
  Top 0.152: U1.31 50.23,47.47 76.44,47.47 GPIO6.I/O
LED0
  Top 0.152: U$9.6 24.02,31.77 23.71,31.77 22.49,32.99 22.49,36.35 29.66,43.51 30.42,43.51 R5.1
LED1
  Top 0.152: U$9.7 24.17,32.38 24.63,32.38 30.27,38.02 31.03,38.02 31.94,38.94 31.94,42.44 33.01,43.51 R6.1
LED2
  Top 0.152: U$9.8 24.17,33.15 24.63,33.15 29.35,37.87 29.35,41.98 30.11,42.75 31.18,42.75 32.25,43.81 32.25,44.12 32.55,44.42 34.84,44.42 35.6,43.66 R7.1
LED3  (via drill 0.3)
  Top 0.152: v28.13,37.41 24.47,33.76 24.17,33.76 U$9.9 | v37.27,42.75 38.04,43.51 R8.1
  Bottom 0.152: v28.13,37.41 28.13,39.24 31.64,42.75 v37.27,42.75
LED4  (via drill 0.3)
  Top 0.152: v23.1,34.97 23.71,34.36 24.02,34.36 U$9.10 | v39.71,43.36 40.48,43.36 40.63,43.51 R9.1
  Bottom 0.152: v23.1,34.97 23.1,35.43 31.03,43.36 v39.71,43.36
LED5  (via drill 0.3)
  Top 0.152: v28.74,39.09 24.63,34.97 24.17,34.97 U$9.11 | v39.56,42.14 40.17,42.75 42.18,42.75 43.25,43.24 R23.1
  Bottom 0.152: v28.74,39.09 31.79,42.14 v39.56,42.14
N$3
  Top 0.152: 62.42,40.61 61.81,40.61 61.2,41.22 C14.2 | 62.42,40.61 64.1,40.61 64.25,40.77 64.25,42.14 63.18,43.2 63.18,44.58 U$12.CASORD | 62.42,40.61 62.42,38.02 U$11.VBOOT
N$5
  Top 1.27: P2.VCC 68.4,11.39 | 68.4,11.39 67.57,12.22 67.54,12.19 P1.P$1 | SUPPLY.1 78.25,2.3 78.25,4.5 77.79,4.96 68.32,4.96 68.32,11.31 68.4,11.39
N$7
  Top 0.152: U$9.23 18.23,31.62 18.53,31.62 21.88,28.27 21.88,26.59 R16.2
N$8  (via drill 0.3)
  Top 0.152: v21.27,24.46 21.27,23.7 R13.P$2 | v21.27,27.66 18.53,30.4 18.23,30.4 U$9.25
  Bottom 0.152: v21.27,27.66 v21.27,24.46
N$9
  Top 0.152: U$9.1 24.17,28.42 24.17,26.9 24.78,26.29 R17.2
N$10
  Top 0.152: U$9.2 24.17,29.03 24.63,29.03 27.37,26.29 R18.2
N$11
  Top 0.152: U$9.3 24.17,29.64 26.61,29.64 29.96,26.29 R19.2
N$12
  Top 0.152: U$9.4 24.17,30.4 28.44,30.4 32.55,26.29 R20.2
N$13
  Top 0.152: U$9.5 24.17,31.01 30.42,31.01 35.14,26.29 R21.2
N$14
  Top 0.152: R22.P$2 17.46,31.16 18.07,31.16 U$9.24
N$15
  Top 0.152: JP2.4 80.1,9.83 80.1,9.81
  Top 1.27: 64.26,21.65 S1.A2 | 64.26,21.65 64.26,16.26 P1.P$2 65.81,14.71 72.58,14.71 JP2.2 JP2.4 80.1,9.81 JP2.6 | S1.A1 64.35,21.56 64.26,21.65
N$16
  Top 0.152: 50.23,40.61 49.92,40.61 49.16,41.38 C4.1 | 50.23,40.61 52.51,40.61 56.48,44.58 57.39,44.58 U$10.CASORD | 50.23,40.61 50.23,38.02 U$8.VBOOT
N$17
  Top 0.508: SUPPLY.2 79.29,3.8 79.29,4.93 78.22,6 77.09,6 73.21,9.88 73.21,10.1 70.04,13.26 64.53,13.26 64.12,12.86 64.12,11.52 65.1,10.55 P2.GNDBREAK
N$18
  Top 0.152: U$10.A/C 56.48,46.71 51.6,41.83 51.6,41.53 C5.1
N$25
  Top 0.152: U$12.A/C 62.27,46.56 62.27,42.75 63.49,41.53 C15.2
N$26
  Top 0.152: U$11.CP 63.03,38.02 63.03,39.24 63.49,39.7 C15.1
N$27
  Top 0.152: U$8.CP 50.99,38.02 50.99,39.24 51.45,39.7 C5.2
OUT1A  (via drill 0.3)
  Top 0.152: v56.63,36.35 56.63,37.87 U$8.OUT1A | U$15.LEFT2 31.18,4.04 31.18,8.91 U$15.LEFT1
  Bottom 0.152: v56.63,36.35 56.63,33.6 54.5,31.47 54.5,27.81 36.97,10.29 32.4,10.29 31.18,9.07 U$15.LEFT1
OUT1A_2  (via drill 0.3)
  Top 0.152: v68.97,36.65 68.97,37.87 U$11.OUT1A | v72.48,33.15 72.48,27.96 v72.78,27.66 | U$17.LEFT2 51.45,4.04 51.45,8.91 U$17.LEFT1
  Bottom 0.152: v72.48,33.15 v68.97,36.65 | v72.78,27.66 72.48,27.66 53.89,9.07 51.45,9.07 U$17.LEFT1
OUT1B  (via drill 0.3)
  Top 0.152: v48.55,36.96 48.25,37.26 48.25,37.87 U$8.OUT1B | U$13.RIGHT2 26,4.04 26,8.91 U$13.RIGHT1
  Bottom 0.152: v48.55,36.96 50.38,36.96 54.19,33.15 54.19,27.96 36.82,10.59 27.52,10.59 26,9.07 U$13.RIGHT1
OUT1B_2  (via drill 0.3)
  Top 0.152: v59.53,33.45 59.53,37.11 60.29,37.87 U$11.OUT1B | U$16.RIGHT2 46.27,4.04 46.27,8.91 U$16.RIGHT1
  Bottom 0.152: v59.53,33.45 58,33.45 55.87,31.32 55.87,18.67 46.27,9.07 U$16.RIGHT1
OUT2A  (via drill 0.3)
  Top 0.152: v56.78,32.99 56.78,32.08 U$8.OUT2A | U$15.RIGHT2 36.06,4.04 36.06,8.91 U$15.RIGHT1
  Bottom 0.152: v56.78,32.99 56.78,32.69 54.8,30.71 54.8,27.66 36.21,9.07 U$15.RIGHT1
OUT2A_2  (via drill 0.3)
  Top 0.152: v68.97,32.99 68.97,32.08 U$11.OUT2A | v71.87,31.77 71.87,29.95 72.17,29.64 v72.17,25.53 | U$17.RIGHT2 56.32,4.04 56.32,8.91 U$17.RIGHT1
  Bottom 0.152: v68.97,32.99 69.28,32.99 70.5,31.77 v71.87,31.77 | v72.17,25.53 72.17,24.76 56.48,9.07 U$17.RIGHT1
OUT2B  (via drill 0.3)
  Top 0.152: v48.55,32.99 48.4,32.84 48.4,32.08 U$8.OUT2B | U$13.LEFT2 20.97,4.04 20.97,8.91 U$13.LEFT1
  Bottom 0.152: v48.55,32.99 48.25,32.99 25.54,10.29 22.34,10.29 21.12,9.07 U$13.LEFT1
OUT2B_2  (via drill 0.3)
  Top 0.152: v60.29,36.96 60.29,32.08 U$11.OUT2B
  Bottom 0.152: v60.29,36.96 75.83,52.5 76.9,52.5 79.64,49.76 79.64,31.16 57.85,9.37 57.85,7.69 57.7,7.54 42.76,7.54 | 42.76,7.54 41.39,8.91 U$16.LEFT1 | 42.76,7.54 41.39,6.17 41.39,4.04 U$16.LEFT2
PWM0
  Top 0.152: R5.2 30.57,41.68 30.57,39.24 GPIO23S.I/O
PWM1
  Top 0.152: R6.2 33.16,41.68 33.16,39.24 GPIO24S.I/O
PWM2
  Top 0.152: R7.2 35.6,41.68 35.6,39.24 GPIO25S.I/O
PWM3
  Top 0.152: R8.2 38.19,41.68 38.19,39.24 GPIO26S.I/O
PWM4
  Top 0.152: R9.2 40.78,41.68 40.78,39.24 GPIO27S.I/O
PWM5
  Top 0.152: R23.2 43.57,41.66 43.57,39.47 GPIO28S.I/O
RX
  Top 0.152: SERIAL.RX 8.32,46.71 8.32,47.01 12.28,50.98 12.28,51.74 13.2,52.65 17.46,52.65 18.53,53.72 U1.10
SCL
  Top 0.152: 9.84,27.2 8.32,25.68 I2C2.SCL 8.17,25.53 6.95,24.31 6.95,19.58 8.17,18.36 8.17,15.16 I2C3.SCL | 9.84,27.2 12.28,29.64 18.07,29.64 U$9.26 | 9.84,27.2 7.25,29.79 7.25,34.52 8.17,35.43 8.17,36.04 I2C1.SCL 8.32,36.19 13.35,41.22 13.35,51.13 U1.5
SDA
  Top 0.152: U$9.27 18.23,29.03 18.53,29.03 18.84,28.73 18.84,27.51 17.92,26.59 11.37,26.59 8.32,23.54 I2C2.SDA
  Bottom 0.152: I2C3.SDA 8.17,13.18 7.25,14.1 7.25,22.63 8.17,23.54 I2C2.SDA 8.17,23.7 7.25,24.61 7.25,28.73 6.95,29.03 6.95,32.23 8.17,33.45 8.17,34.06 I2C1.SDA 8.17,34.21 5.12,37.26 5.12,45.34 10.91,51.13 U1.3
SDI_SDO  (via drill 0.3)
  Top 0.152: v51.6,32.99 51.6,32.08 U$8.SDI | v52.67,28.12 53.12,27.66 v57.39,27.66 | v71.56,29.49 71.56,31.32 71.26,31.62 71.26,32.23 v71.56,32.54 | v62.42,32.99 62.42,32.08 U$11.SDO
  Bottom 0.152: v51.6,32.99 51.6,29.18 v52.67,28.12 | v57.39,27.66 59.22,29.49 v71.56,29.49 | v71.56,32.54 70.19,32.54 69.13,33.6 67.15,33.6 65.93,32.38 63.03,32.38 v62.42,32.99
TX
  Bottom 0.152: U1.8 14.87,52.65 14.87,50.98 8.62,44.73 8.32,44.73 SERIAL.TX
VCC
  Top 0.152: 60.29,39.47 60.29,41.83 61.2,42.75 61.2,44.58 U$12.ANORD 61.2,44.73 60.59,45.34 56.78,45.34 56.17,44.73 55.72,44.73 U$10.ANORD | C11.1 61.05,30.4 61.05,30.27 | JP2.3 80.1,7.39 80.1,7.27 | GPIO24S.VCC 33.16,36.65 | GPIO26S.VCC 38.19,36.65 | GPIO28S.VCC 43.37,36.65
  Top 0.305: C7.1 U$8.VSB2 | 55.42,31.87 55.61,31.68 55.61,31.43 56.17,30.87 C8.1 | 55.42,31.87 55.36,31.93 | 55.42,31.87 55.23,31.68 55.23,31.43 54.12,30.32 C10.1 | C11.1 61.08,31.99 U$11.VSB2 | 67.68,31.92 67.75,31.85 67.75,31.45 68.19,31.01 C13.1 | 67.68,31.92 U$11.VSA2 | 67.68,31.92 67.37,31.61 67.37,31.45 66.31,30.39 C12.1 | 61.54,39.06 61.68,38.92 | C6.1 U$8.VSA | 49.59,38.91 49.59,38.8 49.59,38.02 U$8.VSB
  Top 0.406: 55.36,31.93 U$8.VSA2
  Top 0.61: C4.2 49.03,39.47 49.59,38.91 | U$8.VSB 49.54,38.75 49.59,38.8 | U$8.VSA C6.1 | U$11.VSB 61.68,38.92 | C14.1 61.54,39.06 | U$11.VSA 68.21,39.62 C16.1
  Top 0.813: 57.65,20.75 S1.K
  Top 1.016: S1.K 57.22,20.32 | 71.12,25.14 57.65,25.14 57.65,20.75 | A5.+ 71.12,25.14 | 58.55,30.27 C8.1 49.03,30.27 C7.1 45.83,30.4 45.82,30.39 45.82,36.42 | 58.55,30.27 61.05,30.27 68.01,30.27 C13.1 68.68,29.96 68.91,29.96 70.48,28.38 | 70.48,28.38 71.12,27.74 71.12,25.14 | C6.1 58.49,39.47 | 58.49,39.47 60.29,39.47 60.66,39.47 C14.1 | 58.55,30.27 58.55,39.41 58.49,39.47 | 70.48,28.38 70.48,39.54 70.49,39.55 70.35,39.69 C16.1 | 45.82,36.42 45.82,39.67 45.92,39.77 C4.2 | 45.82,36.42 45.59,36.65 43.37,36.65 GPIO27S.VCC 38.19,36.65 GPIO26S.VCC GPIO25S.VCC 33.16,36.65 GPIO24S.VCC GPIO23S.VCC
  Top 1.27: JP2.1 JP2.3 80.1,7.27 JP2.5 82.56,7.62 84.11,9.17 84.11,10.45 77.35,17.21 75.46,17.21 | 75.46,17.21 C100.2 | A5.+ 75.43,17.24 75.46,17.21

### Text on the board
tPlace: GND | VCC | RX | I/O | TX | VCC | GND | GND | VCC | I/O | I/O | SCL | VCC | SDA | GND | PWM0 | PWM1 | PWM2 | PWM3 | PWM4 | PWM5 | VCC | VCC | GND | I/O | SCL | SDA | VCC | GND | #607 | Stepping Motor Shield / for Raspberry Pi | Rev.1.0.0A | SCL | OUT2B | OUT1B | OUT1A | OUT2A | OUT2B | OUT1B | OUT1A | OUT2A | SDA | VCC | GND | Designed in Aizu | 12V(EIAJ2) | 5V | GND